# EAGLE design acdr (EAGLE 7.7.0)
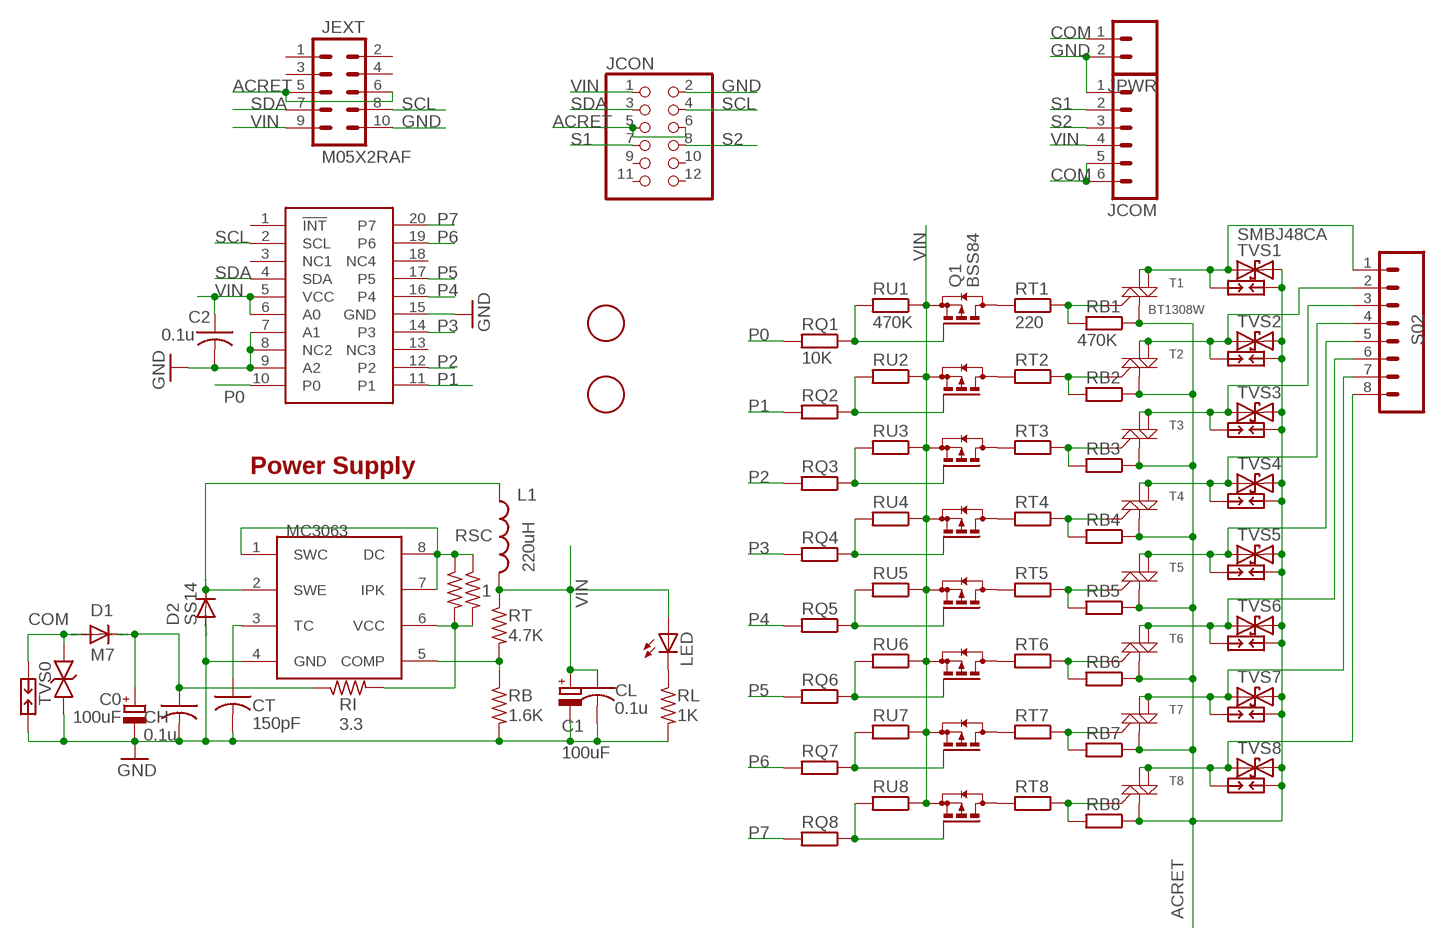
[diagram p0: schematic, sheet 1]

## Parts
C0  100uF  CPOL-EUE  [PANASONIC_E]
C1  100uF  CPOL-EUD  [PANASONIC_D]
C2  0.1u  C-USC0603  [C0603]
CH  0.1u  C-USC0603  [C0603]
CL  0.1u  C-USC0603  [C0603]
CT  150pF  C-USC0603K  [C0603K]
D1  M7  DIODE-DO-214AC  [DO-214AC]
D2  SS14  DIODE-DO-214AC  [DO-214AC]
JCOM  M065MM  [SCREWTERMINAL-5MM-6]
JCON  PINHD-2X6  [2X06]
JEXT  M05X2RAF  [2X5-RAF]
JPWR  M024MM-X  [SCREWTERMINAL-4MM-2-X]
L1  220uH  INDUCTORSRU1038  [SRU1038]
LED  LEDCHIPLED_0805  [CHIPLED_0805]
MC3063  34063  MC33063/MC34063D  [SO08]
PCF8574  PCF8574  [SSOP20]
Q1  BSS84  [SOT23]
Q2  BSS84  [SOT23]
Q3  BSS84  [SOT23]
Q4  BSS84  [SOT23]
Q5  BSS84  [SOT23]
Q6  BSS84  [SOT23]
Q7  BSS84  [SOT23]
Q8  BSS84  [SOT23]
RB  1.6K  R-US_R0603  [R0603]
RB1  470K  R-EU_R0603  [R0603]
RB2  470K  R-EU_R0603  [R0603]
RB3  470K  R-EU_R0603  [R0603]
RB4  470K  R-EU_R0603  [R0603]
RB5  470K  R-EU_R0603  [R0603]
RB6  470K  R-EU_R0603  [R0603]
RB7  470K  R-EU_R0603  [R0603]
RB8  470K  R-EU_R0603  [R0603]
RI  3.3  R-US_R2010  [R2010]
RL  1K  R-US_R0603  [R0603]
RQ1  10K  R-EU_R0603  [R0603]
RQ2  10K  R-EU_R0603  [R0603]
RQ3  10K  R-EU_R0603  [R0603]
RQ4  10K  R-EU_R0603  [R0603]
RQ5  10K  R-EU_R0603  [R0603]
RQ6  10K  R-EU_R0603  [R0603]
RQ7  10K  R-EU_R0603  [R0603]
RQ8  10K  R-EU_R0603  [R0603]
RSC  1  R-US_R0805  [R0805]
RSC1  1  R-US_R0805  [R0805]
RT  4.7K  R-US_R0805  [R0805]
RT1  220  R-EU_R0603  [R0603]
RT2  220  R-EU_R0603  [R0603]
RT3  220  R-EU_R0603  [R0603]
RT4  220  R-EU_R0603  [R0603]
RT5  220  R-EU_R0603  [R0603]
RT6  220  R-EU_R0603  [R0603]
RT7  220  R-EU_R0603  [R0603]
RT8  220  R-EU_R0603  [R0603]
RU1  470K  R-EU_R0603  [R0603]
RU2  470K  R-EU_R0603  [R0603]
RU3  470K  R-EU_R0603  [R0603]
RU4  470K  R-EU_R0603  [R0603]
RU5  470K  R-EU_R0603  [R0603]
RU6  470K  R-EU_R0603  [R0603]
RU7  470K  R-EU_R0603  [R0603]
RU8  470K  R-EU_R0603  [R0603]
S02  M085MM-8  [SCREWTERMINAL-5MM-8]
SP0  PCB-SGAP  [PCB-SGAP]
SP1  PCB-SGAP  [PCB-SGAP]
SP2  PCB-SGAP  [PCB-SGAP]
SP3  PCB-SGAP  [PCB-SGAP]
SP4  PCB-SGAP  [PCB-SGAP]
SP5  PCB-SGAP  [PCB-SGAP]
SP6  PCB-SGAP  [PCB-SGAP]
SP7  PCB-SGAP  [PCB-SGAP]
SP8  PCB-SGAP  [PCB-SGAP]
T1  BT1308W  MAC97SOT223  [SOT223]
T2  MAC97SOT223  [SOT223]
T3  MAC97SOT223  [SOT223]
T4  MAC97SOT223  [SOT223]
T5  MAC97SOT223  [SOT223]
T6  MAC97SOT223  [SOT223]
T7  MAC97SOT223  [SOT223]
T8  MAC97SOT223  [SOT223]
TVS0  43CA  DIODE-BTVSSMB  [SMB]
TVS1  SMBJ48CA  TVSSMB  [SMB]
TVS2  TVSSMB  [SMB]
TVS3  TVSSMB  [SMB]
TVS4  TVSSMB  [SMB]
TVS5  TVSSMB  [SMB]
TVS6  TVSSMB  [SMB]
TVS7  TVSSMB  [SMB]
TVS8  TVSSMB  [SMB]
U$1  FIDUCIAL  [FIDUCIAL_1MM]
U$2  FIDUCIAL  [FIDUCIAL_1MM]

## Nets
ACRET: JCON.5 JCON.6 JEXT.5 JEXT.6 RB1.1 RB2.1 RB3.1 RB4.1 RB5.1 RB6.1 RB7.1 RB8.1 SP1.1 SP2.1 SP3.1 SP4.1 SP5.1 SP6.1 SP7.1 SP8.1 T1.1(M1) T2.1(M1) T3.1(M1) T4.1(M1) T5.1(M1) T6.1(M1) T7.1(M1) T8.1(M1) TVS1.C TVS2.C TVS3.C TVS4.C TVS5.C TVS6.C TVS7.C TVS8.C
COM [power]: D1.A JCOM.5 JCOM.6 JPWR.1 SP0.1 TVS0.C
GND [power]: C0.- C1.- C2.2 CH.2 CL.2 CT.2 D2.A JCOM.1 JCON.2 JEXT.10 JPWR.2 MC3063.4(GND) PCF8574.7(A1) PCF8574.8(NC2) PCF8574.9(A2) PCF8574.15(GND) RB.2 RL.2 SP0.2 TVS0.A
N$1 [power]: MC3063.1(SWC) MC3063.7(IPK) MC3063.8(DC) RSC1.1 RSC.1
N$2: Q1.3(D) RT1.2
N$3: Q2.3(D) RT2.2
N$4: Q3.3(D) RT3.2
N$5: Q4.3(D) RT4.2
N$6: Q5.3(D) RT5.2
N$7: Q6.3(D) RT6.2
N$8: RB1.2 RT1.1 T1.3(G)
N$9: RB2.2 RT2.1 T2.3(G)
N$10: Q7.3(D) RT7.2
N$11: Q8.3(D) RT8.2
N$12: Q1.1(G) RQ1.1 RU1.2
N$13: Q2.1(G) RQ2.1 RU2.2
N$14: Q3.1(G) RQ3.1 RU3.2
N$15: RB3.2 RT3.1 T3.3(G)
N$16: RB4.2 RT4.1 T4.3(G)
N$17 [power]: D2.C L1.1 MC3063.2(SWE)
N$18: RB5.2 RT5.1 T5.3(G)
N$19: RB6.2 RT6.1 T6.3(G)
N$20: Q4.1(G) RQ4.1 RU4.2
N$21: RB7.2 RT7.1 T7.3(G)
N$22: RB8.2 RT8.1 T8.3(G)
N$23: Q5.1(G) RQ5.1 RU5.2
N$24: CT.1 MC3063.3(TC)
N$25: Q6.1(G) RQ6.1 RU6.2
N$26: MC3063.5(COMP) RB.1 RT.2
N$27 [power]: MC3063.6(VCC) RI.2 RSC1.2 RSC.2
N$28: LED.C RL.1
N$31: Q7.1(G) RQ7.1 RU7.2
N$32: Q8.1(G) RQ8.1 RU8.2
N$50 [power]: S02.1 SP1.2 T1.2(M2) T1.4(M2-4) TVS1.A
N$51 [power]: S02.2 SP2.2 T2.2(M2) T2.4(M2-4) TVS2.A
N$52 [power]: S02.3 SP3.2 T3.2(M2) T3.4(M2-4) TVS3.A
N$53 [power]: S02.4 SP4.2 T4.2(M2) T4.4(M2-4) TVS4.A
N$54 [power]: S02.5 SP5.2 T5.2(M2) T5.4(M2-4) TVS5.A
N$55 [power]: S02.6 SP6.2 T6.2(M2) T6.4(M2-4) TVS6.A
N$56 [power]: S02.7 SP7.2 T7.2(M2) T7.4(M2-4) TVS7.A
N$57 [power]: S02.8 SP8.2 T8.2(M2) T8.4(M2-4) TVS8.A
P0: PCF8574.10(P0) RQ1.2
P1: PCF8574.11(P1) RQ2.2
P2: PCF8574.12(P2) RQ3.2
P3: PCF8574.14(P3) RQ4.2
P4: PCF8574.16(P4) RQ5.2
P5: PCF8574.17(P5) RQ6.2
P6: PCF8574.19(P6) RQ7.2
P7: PCF8574.20(P7) RQ8.2
RECAC [power]: C0.+ CH.1 D1.C RI.1
S1: JCOM.2 JCON.7
S2: JCOM.3 JCON.8
SCL: JCON.4 JEXT.8 PCF8574.2(SCL)
SDA: JCON.3 JEXT.7 PCF8574.4(SDA)
VIN [power]: C1.+ C2.1 CL.1 JCOM.4 JCON.1 JEXT.9 L1.2 LED.A PCF8574.5(VCC) PCF8574.6(A0) Q1.2(S) Q2.2(S) Q3.2(S) Q4.2(S) Q5.2(S) Q6.2(S) Q7.2(S) Q8.2(S) RT.1 RU1.1 RU2.1 RU3.1 RU4.1 RU5.1 RU6.1 RU7.1 RU8.1
Unconnected: JCON.9 JCON.10 JCON.11 JCON.12 JEXT.1 JEXT.2 JEXT.3 JEXT.4 PCF8574.1(!INT) PCF8574.3(NC1) PCF8574.13(NC3) PCF8574.18(NC4)

## Notes on the sheet
- Power Supply

## Library data of the parts
C0 C1 = resistor:CPOL-EU: POLARIZED CAPACITOR, European symbol
C2 CH CL CT = adafruit:C-US: CAPACITOR, American symbol
D1 D2 = diode:DIODE-: DIODE
JCOM = SparkFun:M06: Header 6 Standard 6-pin 0.1" header. Use with straight break away headers (SKU : PRT-00116), right angle break away headers (PRT-00553), swiss pins (PRT-00743), machine pins (PRT-00117), and female headers (PRT-00115). Molex polarized connector foot print use with SKU : PRT-08094 with associated crimp pins and housings. NOTES ON THE VARIANTS LOCK and LOCK_LONGPADS... This footprint was designed to help hold the alignment of a through-hole component (i.e. 6-pin header) while soldering it into place. You may notice that each hole has been shifted either up or down by 0.005 of an inch from it's more standard position (which is a perfectly straight line). This slight alteration caused the pins (the squares in the middle) to touch the edges of the holes. Because they are alternating, it causes a "brace" to hold the component in place. 0.005 has proven to be the perfect amount of "off-center" position when using our standard breakaway headers. Although looks a little odd when you look at the bare footprint, once you have a header in there, the alteration is very hard to notice. Also, if you push a header all the way into place, it is covered up entirely on the bottom side. This idea of altering the position of holes to aid alignment will be further integrated into the Sparkfun Library for other footprints. It can help hold any component with 3 or more connection pins.
JCON = pinhead:PINHD-2X6: PIN HEADER
JEXT = SparkFunNew:M05X2: Header 5x2 Standard 10-pin dual row 0.1" header. Commonly used with AVR-ISP. Use with Spark Fun Electronics SKU: PRT-00778
JPWR = SparkFun:M02: Header 2 Standard 2-pin 0.1" header. Use with straight break away headers (SKU : PRT-00116), right angle break away headers (PRT-00553), swiss pins (PRT-00743), machine pins (PRT-00117), and female headers (PRT-00115). Molex polarized connector foot print use with SKU : PRT-08233 with associated crimp pins and housings.
L1 = SparkFunNew:INDUCTOR: Inductors Basic Inductor/Choke - 0603 and 1206. Footprints are not proven and vary greatly between part numbers.
LED = adafruit:LED: LED OSRAM: - CHIPLED LG R971, LG N971, LY N971, LG Q971, LY Q971, LO R971, LY R971 LH N974, LH R974 LS Q976, LO Q976, LY Q976 LO Q996 - Hyper CHIPLED LW Q18S LB Q993, LB Q99A, LB R99A - SideLED LS A670, LO A670, LY A670, LG A670, LP A670 LB A673, LV A673, LT A673, LW A673 LH A674 LY A675 LS A676, LA A676, LO A676, LY A676, LW A676 LS A679, LY A679, LG A679 - Hyper Micro SIDELED® LS Y876, LA Y876, LO Y876, LY Y876 LT Y87S - SmartLED LW L88C, LW L88S LB L89C, LB L89S, LG L890 LS L89K, LO L89K, LY L89K LS L896, LA L896, LO L896, LY L896 - TOPLED LS T670, LO T670, LY T670, LG T670, LP T670 LSG T670, LSP T670, LSY T670, LOP T670, LYG T670 LG T671, LOG T671, LSG T671 LB T673, LV T673, LT T673, LW T673 LH T674 LS T676, LA T676, LO T676, LY T676, LB T676, LH T676, LSB T676, LW T676 LB T67C, LV T67C, LT T67C, LS T67K, LO T67K, LY T67K, LW E67C LS E67B, LA E67B, LO E67B, LY E67B, LB E67C, LV E67C, LT E67C LW T67C LS T679, LY T679, LG T679 LS T770, LO T770, LY T770, LG T770, LP T770 LB T773, LV T773, LT T773, LW T773 LH T774 LS E675, LA E675, LY E675, LS T675 LS T776, LA T776, LO T776, LY T776, LB T776 LHGB T686 LT T68C, LB T68C - Hyper Mini TOPLED® LB M676 - Mini TOPLED Santana® LG M470 LS M47K, LO M47K, LY M47K Source: http://www.osram.convergy.de/
MC3063 = adafruit:MC33063/MC34063: MC33063 and MC34063 Basic DC/DC converter with internal power-NPN transistor, 100KHz, 1.5A peak switch current. 3-40 input/output.
PCF8574 = SparkFunNew:PCF8574
Q1-Q8 = transistor-small-signal:BSS84: P-CHANNEL MOS FET
RB RI RSC RSC1 RT = adafruitGood:R-US_: RESISTOR, American symbol
RB1-RB8 RQ1-RQ8 RT1-RT8 RU1-RU8 = rcl:R-EU_: RESISTOR, European symbol
RL = adafruit2013:R-US_: RESISTOR, American symbol
S02 = SparkFun:M08: Header 8 Standard 8-pin 0.1" header. Use with straight break away headers (SKU : PRT-00116), right angle break away headers (PRT-00553), swiss pins (PRT-00743), machine pins (PRT-00117), and female headers (PRT-00115).
SP0 SP1-SP8 = varistor:PCB-SGAP
T1-T8 = SparkFun:MAC97: MAC97 Triac http://www.onsemi.com/pub_link/Collateral/MAC97-D.PDF
TVS0 = diode:DIODE-BTVS
TVS1-TVS8 = SparkFunNew:TVS
U$1 U$2 = adafruitGood:FIDUCIAL: For use by pick and place machines to calibrate the vision/machine, 1mm By microbuilder.eu

## Net classes
0 default: width 0.203 mm, clearance 0.178 mm
1 power: width 0.203 mm, clearance 0.178 mm
2 relaypower: width 0.508 mm, clearance 0.508 mm

## Board
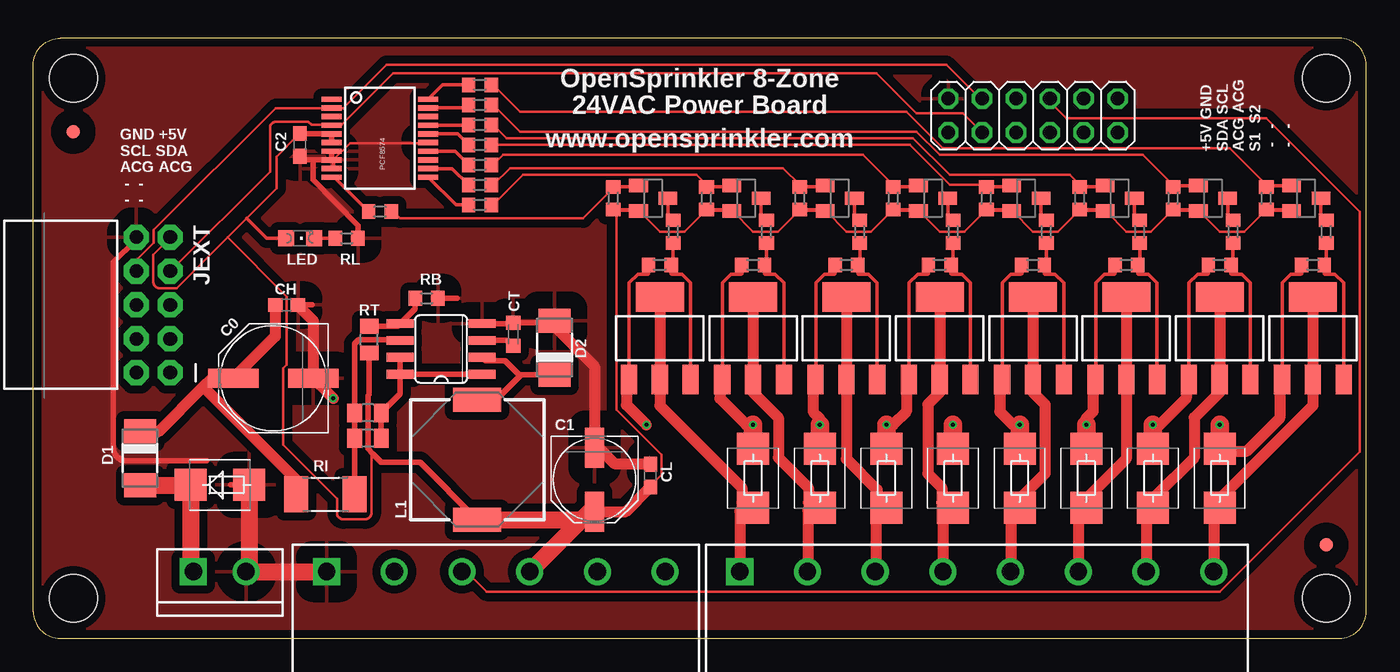
[diagram p1: board, top side]
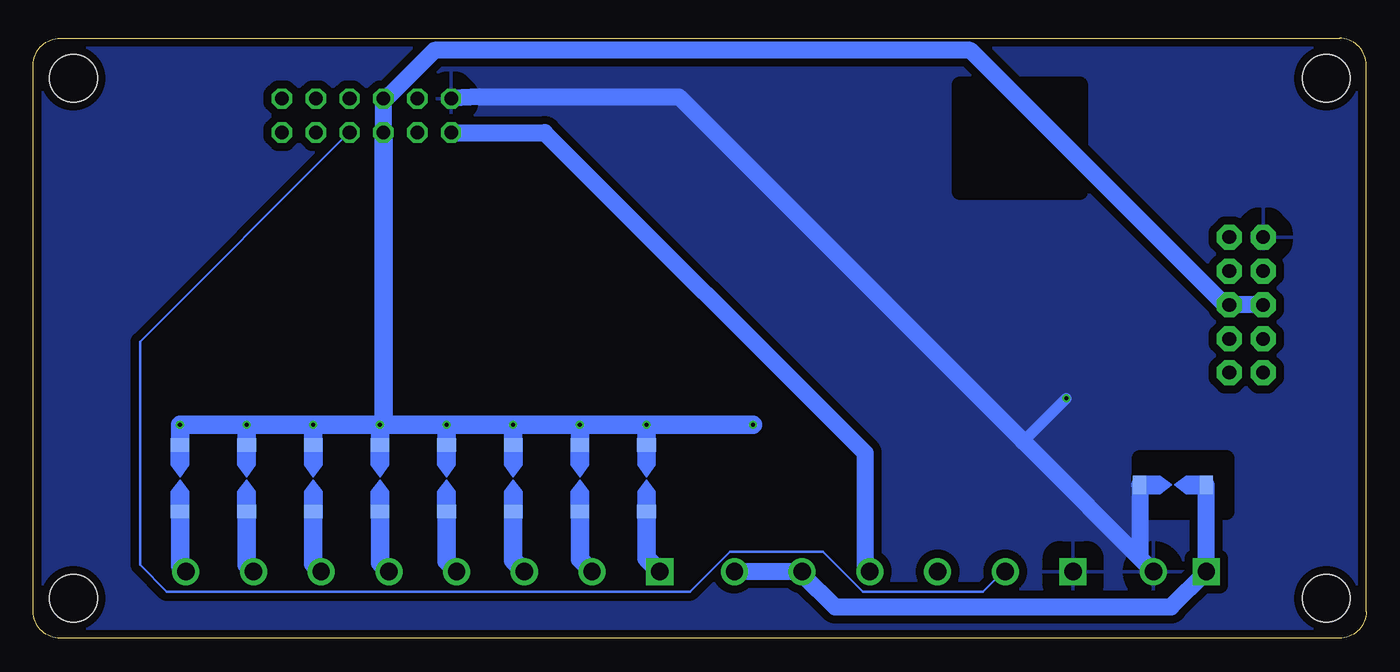
[diagram p2: board, bottom side, seen from below]

Size 100 x 45 mm. Coordinates in mm from the lower left corner, seen from the top.
Outline: 2,0 98,0 arc90 100,2 100,43 arc90 98,45 2,45 arc90 0,43 0,2 arc90 2,0
Copper layers (1*16): Top 0.035mm / dielectric 1.5mm / Bottom 0.035mm
Design rules "Fusion_eagle_rule_v1.1 *": minimum track width 6mil, minimum drill 12mil, track to track 6mil, track to pad 6mil, pad to pad 6mil, via to via 6mil, smd to smd 0mil, copper to edge 10mil, drill to drill 10mil, minimum pad ring 10mil, minimum via ring 6mil, stop-mask expansion 2mil, vias tented up to drill 100mil, thermal gap 50mil
Holes 3.6 mm at 3,3 97,3 3,42 97,42
bRestrict: area 10.5,9.5 to 17,13.5; area 21.5,33.5 to 30.5,41.5

### Footprints (pad centres in the part's own frame; a part is rotated, then mirrored left to right if it is on the bottom)
PANASONIC_E = smd 3.8 x 1.4: + 3,0; - -3,0
PANASONIC_D = smd 3 x 1.4: + 2.4,0; - -2.4,0
C0603 = smd 1.1 x 1: 1 -0.85,0; 2 0.85,0
C0603K = smd 1.05 x 1.08: 1 -0.875,0; 2 0.875,0
DO-214AC = smd 1.8 x 2.4: A 2.025,0; C -2.025,0
SCREWTERMINAL-5MM-6 = drill 1.3 pad 2.032 square: 1 0,0 | drill 1.3 pad 2.032: 2 5.08,0; 3 10.16,0; 4 15.24,0; 5 20.32,0; 6 25.4,0
2X06 = drill 1.016 octagon: 1 -6.35,-1.27; 2 -6.35,1.27; 3 -3.81,-1.27; 4 -3.81,1.27; 5 -1.27,-1.27; 6 -1.27,1.27; 7 1.27,-1.27; 8 1.27,1.27; 9 3.81,-1.27; 10 3.81,1.27; 11 6.35,-1.27; 12 6.35,1.27
2X5-RAF = drill 1.016 pad 1.88 octagon: 1 -1.27,5.08; 2 1.27,5.08; 3 -1.27,2.54; 4 1.27,2.54; 5 -1.27,0; 6 1.27,0; 7 -1.27,-2.54; 8 1.27,-2.54; 9 -1.27,-5.08; 10 1.27,-5.08
SCREWTERMINAL-4MM-2-X = drill 1.3 pad 2.032 square: 1 0,0 | drill 1.3 pad 2.032: 2 3.96,0
SRU1038 = smd 1.8 x 3.6: 1 -4.5,0; 2 4.5,0
CHIPLED_0805 = smd 1.2 x 1.2: A 0,-1.05; C 0,1.05
SO08 = smd 0.66 x 2.032: 1 -1.905,-3.073; 2 -0.635,-3.073; 3 0.635,-3.073; 4 1.905,-3.073; 5 1.905,3.073; 6 0.635,3.073; 7 -0.635,3.073; 8 -1.905,3.073
SSOP20 = smd 0.4 x 1.5: 1 -2.925,-3.625; 2 -2.275,-3.625; 3 -1.625,-3.625; 4 -0.975,-3.625; 5 -0.325,-3.625; 6 0.325,-3.625; 7 0.975,-3.625; 8 1.625,-3.625; 9 2.275,-3.625; 10 2.925,-3.625; 11 2.925,3.625; 12 2.275,3.625; 13 1.625,3.625; 14 0.975,3.625; 15 0.325,3.625; 16 -0.325,3.625; 17 -0.975,3.625; 18 -1.625,3.625; 19 -2.275,3.625; 20 -2.925,3.625
SOT23 = smd 1 x 1.4: 1 -0.95,-1.1; 2 0.95,-1.1; 3 0,1.1
R0603 = smd 1 x 1.1: 1 -0.85,0; 2 0.85,0
R2010 = smd 1.8 x 2.7: 1 -2.2,0; 2 2.2,0
R0805 = smd 1.1 x 1.4: 1 -1,0; 2 1,0
SCREWTERMINAL-5MM-8 = drill 1.3 pad 2.032 square: 1 0,0 | drill 1.3 pad 2.032: 2 5.08,0; 3 10.16,0; 4 15.24,0; 5 20.32,0; 6 25.4,0; 7 30.48,0; 8 35.56,0
PCB-SGAP = smd 1 x 1.4 bottom: 1 -2.5,0; 2 2.5,0
SOT223 = smd 1.219 x 2.235: 1 -2.311,-3.099; 2 0,-3.099; 3 2.311,-3.099 | smd 3.6 x 2.2: 4 0,3.099
SMB = smd 2.4 x 2.4: A 2.2,0; C -2.2,0
FIDUCIAL_1MM = smd 1 x 1: 1 0,0

### Placement (x,y rotation side)
C0  18,19.5 180 top
C1  42.1,11.9 270 top
C2  20,37 270 top
CH  19,25 0 top
CL  46.3,12.2 90 top
CT  36,22.8 90 top
D1  8,13.5 270 top
D2  39.1,21.8 90 top
JCOM  22,5 0 top
JCON  75,39.2 0 top
JEXT  9,25 180 top
JPWR  12,5 0 top
L1  33.3,13.4 270 top
LED  20,30 270 top
MC3063  30.6,21.7 90 top
PCF8574  26,37.5 270 top
Q1  46.5,33 270 top
Q2  53.5,33 270 top
Q3  60.5,33 270 top
Q4  67.5,33 270 top
Q5  74.5,33 270 top
Q6  81.5,33 270 top
Q7  88.5,33 270 top
Q8  95.5,33 270 top
RB  29.5,25.5 0 top
RB1  47,28 0 top
RB2  54,28 0 top
RB3  61,28 0 top
RB4  68,28 0 top
RB5  75,28 0 top
RB6  82,28 0 top
RB7  89,28 0 top
RB8  96,28 0 top
RI  21.9,10.8 0 top
RL  23.5,30 0 top
RQ1  26,32 180 top
RQ2  33.5,32.5 180 top
RQ3  33.5,34 180 top
RQ4  33.5,35.5 180 top
RQ5  33.5,37 180 top
RQ6  33.5,38.5 180 top
RQ7  33.5,40 180 top
RQ8  33.5,41.5 180 top
RSC  25.1,15 180 top
RSC1  25.1,16.9 180 top
RT  25.2,22.4 90 top
RT1  48,30.5 90 top
RT2  55,30.5 90 top
RT3  62,30.5 90 top
RT4  69,30.5 90 top
RT5  76,30.5 90 top
RT6  83,30.5 90 top
RT7  90,30.5 90 top
RT8  97,30.5 90 top
RU1  43.5,33 90 top
RU2  50.5,33 90 top
RU3  57.5,33 90 top
RU4  64.5,33 90 top
RU5  71.5,33 90 top
RU6  78.5,33 90 top
RU7  85.5,33 90 top
RU8  92.5,33 90 top
S02  53,5 0 top
SP0  14.5,11.5 0 top
SP1  54,12 270 top
SP2  59,12 270 top
SP3  64,12 270 top
SP4  69,12 270 top
SP5  74,12 270 top
SP6  79,12 270 top
SP7  84,12 270 top
SP8  89,12 270 top
T1  47,22.5 0 top
T2  54,22.5 0 top
T3  61,22.5 0 top
T4  68,22.5 0 top
T5  75,22.5 0 top
T6  82,22.5 0 top
T7  89,22.5 0 top
T8  96,22.5 0 top
TVS0  14,11.5 0 top
TVS1  54,12 270 top
TVS2  59,12 270 top
TVS3  64,12 270 top
TVS4  69,12 270 top
TVS5  74,12 270 top
TVS6  79,12 270 top
TVS7  84,12 270 top
TVS8  89,12 270 top
U$1  3,38 0 top
U$2  97,7 0 top

### Tracks (layer width: path | path; a pad name or v marks a point on that pad's centre or on a via)
ACRET  (via drill 0.3)
  Top 0.254: RB1.1 46.15,27.35 46.1,27.3 45.35,27.3 44.7,26.65 44.7,19.8 T1.1 | RB2.1 53.15,27.35 53.1,27.3 52.35,27.3 51.7,26.65 51.7,19.8 T2.1 | RB3.1 60.15,27.35 60.1,27.3 59.35,27.3 58.7,26.65 58.7,19.8 T3.1 | RB4.1 67.15,27.35 67.1,27.3 66.35,27.3 65.7,26.65 65.7,19.8 T4.1 | RB5.1 74.15,27.35 74.1,27.3 73.35,27.3 72.7,26.65 72.7,19.8 T5.1 | RB6.1 81.15,27.35 81.1,27.3 80.35,27.3 79.7,26.65 79.7,19.8 T6.1 | RB7.1 88.15,27.35 88.1,27.3 87.35,27.3 86.7,26.65 86.7,19.8 T7.1 | RB8.1 95.15,27.35 95.1,27.3 94.35,27.3 93.7,26.65 93.7,19.8 T8.1
  Top 0.813: TVS8.C 89.5,14 91,14 93.5,16.5 93.5,19 T8.1 | v84,16 84.5,16 86.5,18 86.5,19 T7.1 | v79,16 79,16.5 79.5,17 79.5,19 T6.1 | v74,16 73.5,16 72.5,17 72.5,19 T5.1 | v64,16 64.5,16 65.5,17 65.5,19 T4.1 | v59,16 59,16.5 58.5,17 58.5,19 T3.1 | v54,16 53.5,16 51.5,18 51.5,19 T2.1 | v46,16 44.5,17.5 44.5,19 T1.1
  Top 1.4: v54,16 TVS1.C | v59,16 TVS2.C | v64,16 TVS3.C | v69,16 TVS4.C | v74,16 TVS5.C | v79,16 TVS6.C | v84,16 TVS7.C | v89,16 TVS8.C
  Bottom 1.27: JCON.5 73.75,37.95 73.75,40.45 JCON.6 73.2,40.8 69.9,44.1 29.7,44.1 10.85,25.25 JEXT.5 JEXT.6
  Bottom 1.4: SP1.1 v54,16 | SP2.1 v59,16 | SP3.1 v64,16 | SP4.1 v69,16 | SP5.1 v74,16 | SP6.1 v79,16 | SP7.1 v84,16 | SP8.1 v89,16 v84,16 | v79,16 v84,16 | v74,16 v79,16 | v69,16 v74,16 | v64,16 v69,16 | v59,16 v64,16 | v54,16 v59,16 | v46,16 v54,16 | JCON.5 73.73,16.27 v74,16
COM
  Top 1.27: D1.A 11.78,11.47 TVS0.C 11.8,5.2 JPWR.1
  Bottom 1.27: JCOM.6 JCOM.5 42.32,4.82 39.85,2.35 14.65,2.35 JPWR.1 SP0.1
GND  (via drill 0.3)
  Top 0.203: PCF8574.15 29.62,37.12 23.75,37.12 22.5,35.88 PCF8574.8
  Top 0.305: PCF8574.9 22.5,35.25 22.5,35.75 PCF8574.8 | 7.71,30.05 JEXT.10 | 15.69,11.81 TVS0.A | 19.53,25.19 CH.2
  Top 0.406: 21,35.88 PCF8574.8 PCF8574.7 | 21,35.88 20.27,35.88 C2.2 | 13,13.3 7,13.3 arc-90 6,14.3 6,28.2 7.7,29.9 JEXT.10 | 14.8,11.5 TVS0.A | 31.78,25.5 RB.2 30.2,25.6 | MC3063.4 35.93,23.61 CT.2 38.95,23.68 D2.A | CH.2 20.9,25 | 21,35.88 21,34.4 24.35,30.95 RL.2
  Top 0.813: CL.2 46.3,13.1 43.6,13.1 42.5,14.2 C1.- 42.1,20.4 39,23.5 D2.A | 21,20 21,23.8 19.9,24.9 CH.2 | v22.5,18 21.5,19 21.5,19.5 21,20 | 21,20 C0.-
  Top 1.27: JCOM.1 JPWR.2 16.2,5.24 TVS0.A
  Bottom 0.813: v22.5,18 25.73,14.77
  Bottom 1.27: SP0.2 17,6.04 JPWR.2 25.73,14.77 51.56,40.6 66.5,40.6 68.6,40.5 JCON.2
  pour Bottom (isolate 0.61): 0,45 100,45 100,0 0,0
  pour Top (isolate 0.61): 0,45 100,45 100,0 0,0
N$1
  Top 0.406: MC3063.7 MC3063.8 | RSC.1 RSC1.1 27.53,18.33 MC3063.8 | MC3063.8 MC3063.1
N$2
  Top 0.254: Q1.3 47.6,31.75 RT1.2
N$3
  Top 0.254: Q2.3 54.6,31.75 RT2.2
N$4
  Top 0.254: Q3.3 61.6,31.75 RT3.2
N$5
  Top 0.254: Q4.3 68.6,31.75 RT4.2
N$6
  Top 0.254: Q5.3 75.6,31.75 RT5.2
N$7
  Top 0.254: Q6.3 82.6,31.75 RT6.2
N$8
  Top 0.254: T1.3 49.3,19.45 49.3,26.65 48.65,27.3 47.9,27.3 47.85,27.35 RB1.2 48,28.15 RT1.1
N$9
  Top 0.254: T2.3 56.3,19.45 56.3,26.65 55.65,27.3 54.9,27.3 54.85,27.35 RB2.2 55,28.15 RT2.1
N$10
  Top 0.254: Q7.3 89.6,31.75 RT7.2
N$11
  Top 0.254: Q8.3 96.6,31.75 RT8.2
N$12
  Top 0.203: RQ1.1 27,32 27.5,31.5 41.25,31.5 43.5,33.75 RU1.2
  Top 0.254: RU1.2 45.3,33.85 Q1.1
N$13
  Top 0.203: RQ2.1 34.5,32.5 36.75,34.75 49.75,34.75 50.5,34 RU2.2
  Top 0.254: RU2.2 52.3,33.85 Q2.1
N$14
  Top 0.203: RQ3.1 34.5,34 35.75,35.25 56.25,35.25 57.5,34 RU3.2
  Top 0.254: RU3.2 59.3,33.85 Q3.1
N$15
  Top 0.254: T3.3 63.3,19.45 63.3,26.65 62.65,27.3 61.9,27.3 61.85,27.35 RB3.2 62,28.15 RT3.1
N$16
  Top 0.254: T4.3 70.3,19.45 70.3,26.65 69.65,27.3 68.9,27.3 68.85,27.35 RB4.2 69,28.15 RT4.1
N$17
  Top 0.406: D2.C 36.6,19.77 | 36.6,19.77 36.42,19.77 35.4,20.8 33.94,20.8 MC3063.2 | L1.1 34.73,17.9 36.6,19.77
N$18
  Top 0.254: T5.3 77.3,19.45 77.3,26.65 76.65,27.3 75.9,27.3 75.85,27.35 RB5.2 76,28.15 RT5.1
N$19
  Top 0.254: T6.3 84.3,19.45 84.3,26.65 83.65,27.3 82.9,27.3 82.85,27.35 RB6.2 83,28.15 RT6.1
N$20
  Top 0.203: RQ4.1 34.5,35.5 35.25,36.25 62.25,36.25 64.5,34 RU4.2
  Top 0.254: RU4.2 66.3,33.85 Q4.1
N$21
  Top 0.254: T7.3 91.3,19.45 91.3,26.65 90.65,27.3 89.9,27.3 89.85,27.35 RB7.2 90,28.15 RT7.1
N$22
  Top 0.254: T8.3 98.3,19.45 98.3,26.65 97.65,27.3 96.9,27.3 96.85,27.35 RB8.2 97,28.15 RT8.1
N$23
  Top 0.203: RQ5.1 65.75,37 68.75,34 71.5,34 RU5.2
  Top 0.254: RU5.2 73.3,33.85 Q5.1
N$24
  Top 0.406: MC3063.3 35.59,22.34 CT.1
N$25
  Top 0.203: RQ6.1 34.5,38.5 35.5,37.5 66,37.5 68.75,34.75 77.75,34.75 78.5,34 RU6.2
  Top 0.254: RU6.2 80.3,33.85 Q6.1
N$26
  Top 0.406: RT.2 27.32,23.4 MC3063.5 28.65,24.73 RB.1
N$27
  Top 0.406: RI.2 RSC.2 RSC1.2 24.1,22.1 24.4,22.4 27.46,22.4 MC3063.6
N$28
  Top 0.254: LED.C RL.1
N$31
  Top 0.203: RQ7.1 34.5,40 36.5,38 66.25,38 68,36.25 83.25,36.25 85.5,34 RU7.2
  Top 0.254: Q7.1 85.6,33.95 RU7.2
N$32
  Top 0.203: RQ8.1 34.5,41.5 36.5,39.5 65.5,39.5 68.25,36.75 89.75,36.75 92.5,34 RU8.2
  Top 0.254: Q8.1 92.6,33.95 RU8.2
N$50
  Top 0.813: S02.1 53,9.5 53.3,9.8 TVS1.A 53.15,10.2 53.15,11.3 47,17.45 T1.2 T1.4
  Bottom 1.4: SP1.2 54,6 S02.1
N$51
  Top 0.813: S02.2 58.1,5 58.1,9.6 58.3,9.8 TVS2.A 58.15,10.2 58.15,11.3 55.9,13.55 55.9,16.55 54,18.45 T2.2 T2.4
  Bottom 1.4: SP2.2 59,5.92 S02.2
N$52
  Top 0.813: S02.3 63.2,5 63.2,9.55 63.45,9.8 TVS3.A 63.3,10.2 63.3,11.15 61,13.45 T3.2 T3.4
  Bottom 1.4: SP3.2 64,5.84 S02.3
N$53
  Top 0.813: S02.4 68.25,9.75 68.3,9.8 TVS4.A 68.15,10.2 68.15,11.3 67.1,12.35 67.1,17.55 68,18.45 T4.2 T4.4
  Bottom 1.4: SP4.2 69,5.76 S02.4
N$54
  Top 0.813: S02.5 73.35,5 73.35,9.75 73.4,9.8 TVS5.A 74.15,10.2 74.15,10.6 75.9,12.35 75.9,17.55 75,18.45 T5.2 T5.4
  Bottom 1.4: SP5.2 74,5.68 S02.5
N$55
  Top 0.813: S02.6 78.4,9.75 78.45,9.8 TVS6.A 79.15,10.2 79.15,10.6 82,13.45 T6.2 T6.4
  Bottom 1.4: SP6.2 79,5.6 S02.6
N$56
  Top 0.813: S02.7 83.5,5 83.5,9.75 83.55,9.8 TVS7.A 84.15,10.2 84.15,10.6 87.1,13.55 87.1,16.55 89,18.45 T7.2 T7.4
  Bottom 1.4: SP7.2 84,5.52 S02.7
N$57
  Top 0.813: S02.8 88.55,9.75 88.6,9.8 TVS8.A 89.15,10.2 89.15,10.6 96,17.45 T8.2 T8.4
  Bottom 1.4: SP8.2 89,5.44 S02.8
P0
  Top 0.254: PCF8574.10 22.57,34.58 RQ1.2
P1
  Top 0.254: RQ2.2 31.7,32.5 PCF8574.11
P2
  Top 0.254: PCF8574.12 31.43,35.23 RQ3.2
P3
  Top 0.254: PCF8574.14 31.62,36.52 RQ4.2
P4
  Top 0.254: PCF8574.16 31.82,37.83 RQ5.2
P5
  Top 0.254: PCF8574.17 32.62,38.48 RQ6.2
P6
  Top 0.254: PCF8574.19 32.42,39.77 RQ7.2
P7
  Top 0.254: RQ8.2 30.7,41.5 PCF8574.20
RECAC
  Top 0.813: CH.1 18.15,22.65 C0.+ 13.4,19.5 12.75,18.85 | 12.75,18.85 9.4,15.5 8,15.5 D1.C | RI.1 19.7,11.9 12.75,18.85
S1
  Bottom 0.203: JCON.7 76.5,37.75 92,22.25 92,5.5 90,3.5 50.75,3.5 47.75,6.5 40.75,6.5 37.75,3.5 28.75,3.5 27.25,5 JCOM.2
S2
  Top 0.203: JCON.8 76.5,40 77.5,39 92.5,39 99.5,32 99.5,14 89,3.5 34,3.5 32.5,5 JCOM.3
SCL
  Top 0.203: JCON.4 71,40.5 68.5,43 26.5,43 23.25,39.75 22.5,39.75 PCF8574.2 22.29,39.77 18.19,39.77 9.05,30.62 9.05,29.67 7.81,28.43 7.81,27.57 JEXT.8
SDA
  Top 0.203: 22.38,38.5 20.88,38.5 20.62,38.75 18.25,38.75 arc90 17.75,38.25 17.75,35 10.38,27.62 JEXT.7 | 22.38,38.5 23.12,38.5 27,42.38 63.25,42.38 66.25,39.38 69.75,39.38 71.12,38 JCON.3 | 22.38,38.5 PCF8574.4
VIN
  Top 0.203: Q1.2 45.45,32.05 47,30.5 48.85,30.5 RU2.1 | Q2.2 52.45,32.05 54,30.5 55.85,30.5 RU3.1 | Q3.2 59.45,32.05 61,30.5 62.85,30.5 RU4.1 | Q4.2 66.45,32.05 68,30.5 69.85,30.5 RU5.1 | Q5.2 73.45,32.05 75,30.5 76.85,30.5 RU6.1 | Q6.2 80.45,32.05 82,30.5 83.85,30.5 RU7.1 | 87.6,32.1 87.6,31.9 89,30.5 90.85,30.5 RU8.1 | 14.56,30.06 10.75,26.25 9.5,26.25 arc-90 9,26.75 9,28.75 10.25,30 JEXT.9 | 14.56,30.06 16,31.5 18.25,33.75 18.25,36.12 19.88,37.75 C2.1 | RU1.1 43.75,32 43.75,17.12 47.12,13.75 47.12,12.25 46.5,11.62 CL.1 | 14.56,30.06 19,25.62 19,20.5 18.75,20.25 18.75,14.5 22.77,10.47 22.77,9.43 arc90 23.27,8.93 24.88,8.93 arc90 25.38,9.43 25.38,13.75 25.46,13.84
  Top 0.254: LED.A 17.5,30 16,31.5
  Top 0.305: RU1.1 45.3,32.15 Q1.2 | RU2.1 52.3,32.15 Q2.2 | RU3.1 59.3,32.15 Q3.2 | RU4.1 66.3,32.15 Q4.2 | RU5.1 73.3,32.15 Q5.2 | RU6.1 80.3,32.15 Q6.2 | 87.6,32.1 87.55,32.05 Q7.2 87.3,32.15 RU7.1 | RU8.1 94.3,32.15 Q8.2
  Top 0.406: C2.1 22.35,37.85 PCF8574.5 PCF8574.6 | RT.1 25.2,18.3 25.1,18.2 25.1,14.2 25.46,13.84 26.1,13.2 29,13.2 L1.2
  Top 0.813: C1.+ 44.45,9.5 CL.1 | C1.+ 41.74,9.5 | 41.5,8.9 C1.+
  Top 1.27: 41.74,9.5 JCOM.4 | L1.2 41.5,8.9
  Bottom 1.27: JCON.1 61.63,37.93 37.6,13.9 37.6,5.36 JCOM.4

### Text on the board
tNames: OpenSprinkler 8-Zone | 24VAC Power Board | www.opensprinkler.com | +5V GND / SDA SCL / ACG ACG / S1 S2 / - - / - - | GND +5V / SCL SDA / ACG ACG / - - / - -